# Altium schematic sheet ICtester.SchDoc
size B; SheetNumber: 1; SheetTotal: 1
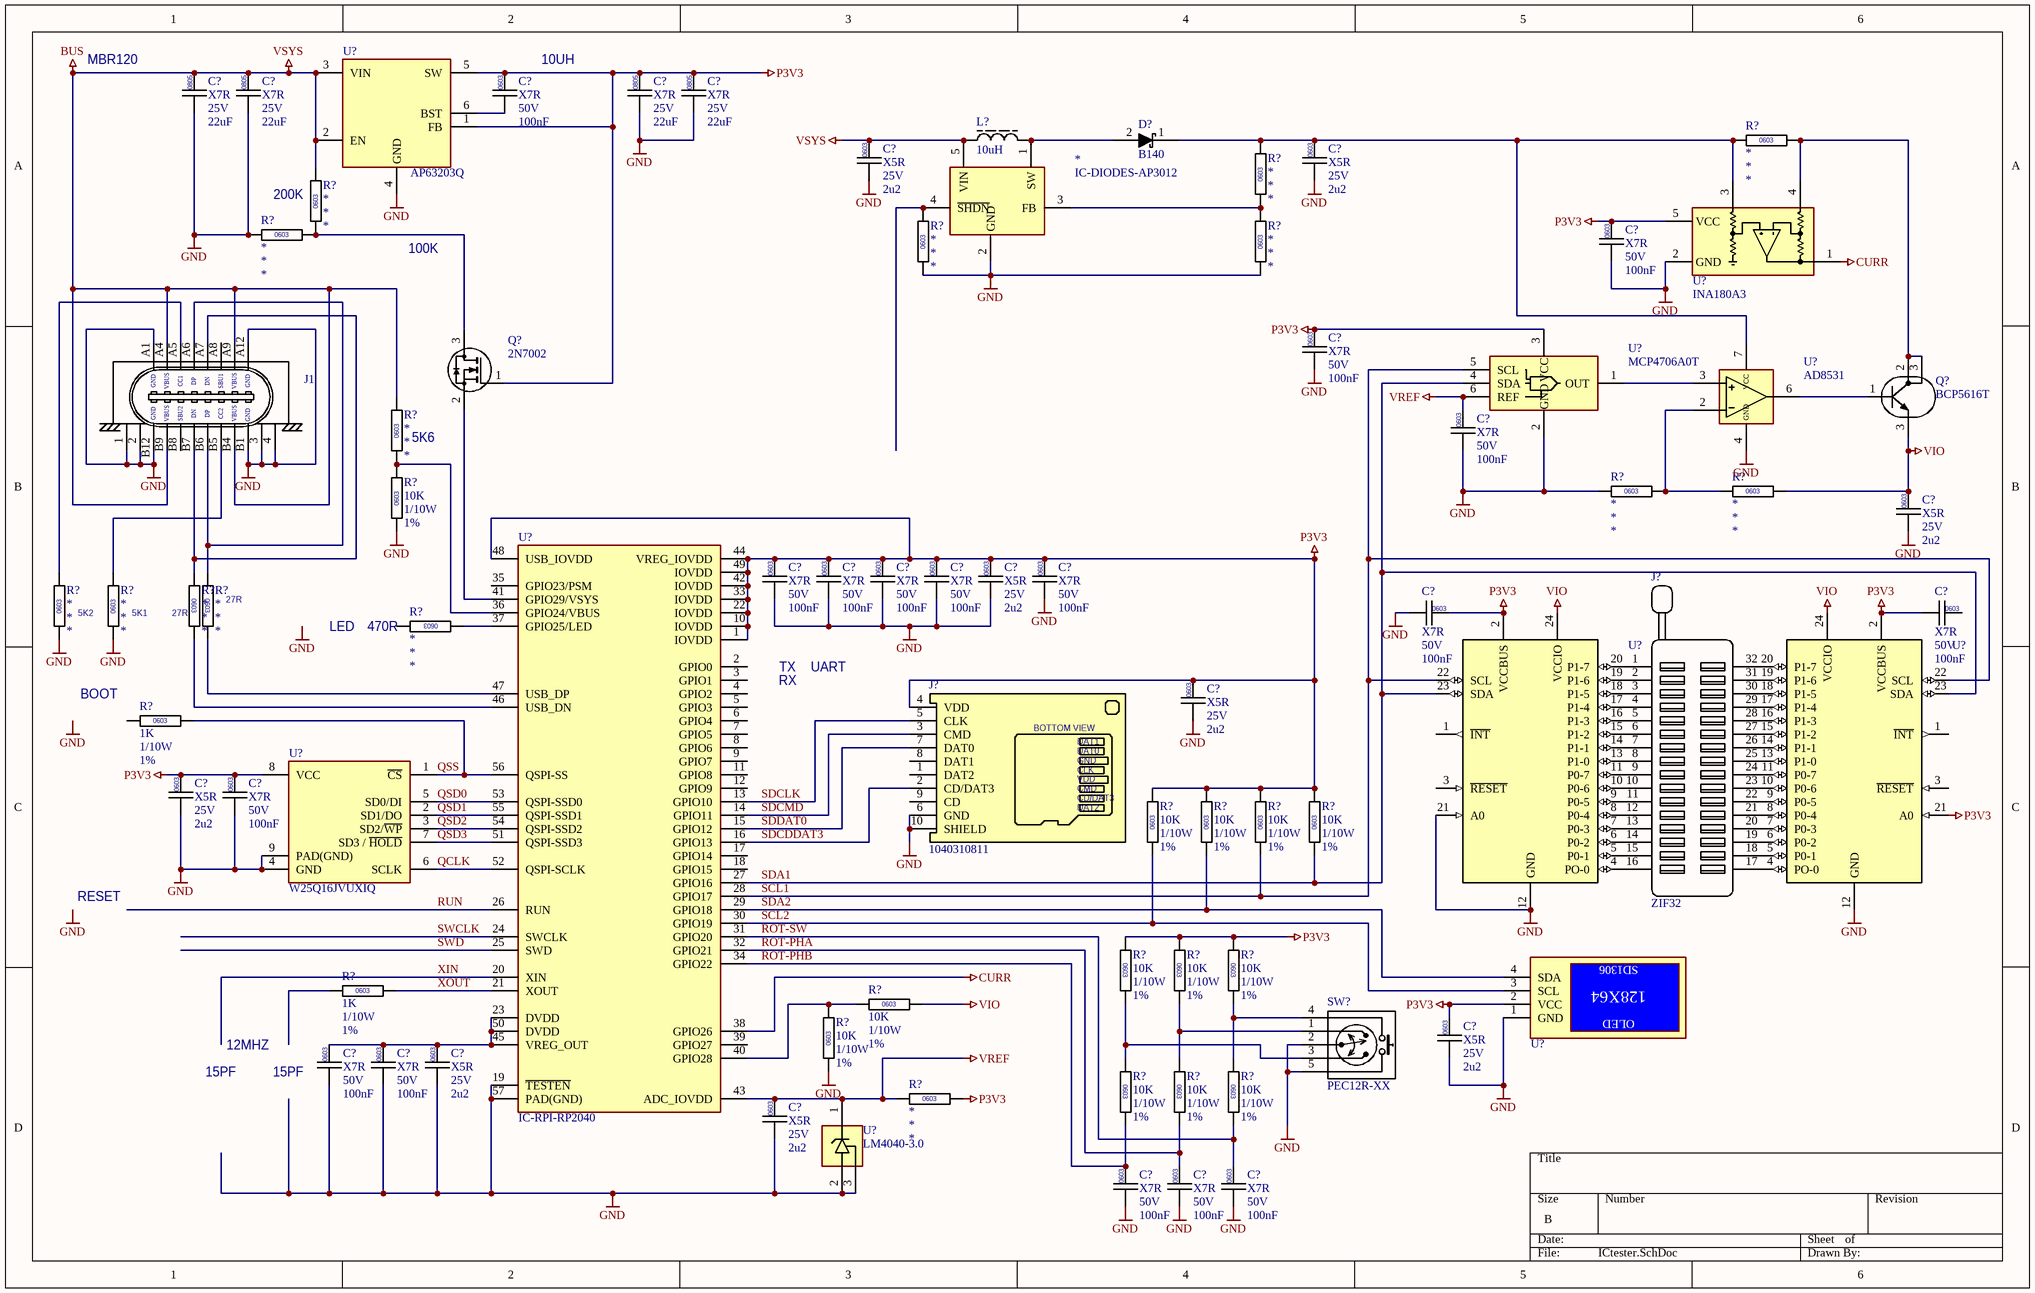
[diagram p0: ICtester.SchDoc]

## Parts
(Parts that share a designator on the sheet are numbered #1, #2 ... from top to bottom, then left to right.)
*  IC-DIODES-AP3012
C?#1  Dielectric: X7R  Voltage: 25V  Capacitance: 22uF  (hidden comment: CAP0805)
C?#2  Dielectric: X7R  Voltage: 25V  Capacitance: 22uF  (hidden comment: CAP0805)
C?#3  Dielectric: X7R  Voltage: 50V  Capacitance: 100nF  (hidden comment: CAP0603)
C?#4  Dielectric: X7R  Voltage: 25V  Capacitance: 22uF  (hidden comment: CAP0805)
C?#5  Dielectric: X7R  Voltage: 25V  Capacitance: 22uF  (hidden comment: CAP0805)
C?#6  Dielectric: X5R  Voltage: 25V  Capacitance: 2u2  (hidden comment: CAP0603)
C?#7  Dielectric: X5R  Voltage: 25V  Capacitance: 2u2  (hidden comment: CAP0603)
C?#8  Dielectric: X7R  Voltage: 50V  Capacitance: 100nF  (hidden comment: CAP0603)
C?#9  Dielectric: X7R  Voltage: 50V  Capacitance: 100nF  (hidden comment: CAP0603)
C?#10  Dielectric: X7R  Voltage: 50V  Capacitance: 100nF  (hidden comment: CAP0603)
C?#11  Dielectric: X5R  Voltage: 25V  Capacitance: 2u2  (hidden comment: CAP0603)
C?#12  Dielectric: X7R  Voltage: 50V  Capacitance: 100nF  (hidden comment: CAP0603)
C?#13  Dielectric: X7R  Voltage: 50V  Capacitance: 100nF  (hidden comment: CAP0603)
C?#14  Dielectric: X7R  Voltage: 50V  Capacitance: 100nF  (hidden comment: CAP0603)
C?#15  Dielectric: X7R  Voltage: 50V  Capacitance: 100nF  (hidden comment: CAP0603)
C?#16  Dielectric: X5R  Voltage: 25V  Capacitance: 2u2  (hidden comment: CAP0603)
C?#17  Dielectric: X7R  Voltage: 50V  Capacitance: 100nF  (hidden comment: CAP0603)
C?#18  Dielectric: X7R  Voltage: 50V  Capacitance: 100nF  (hidden comment: CAP0603)
C?#19  Dielectric: X7R  Voltage: 50V  Capacitance: 100nF  (hidden comment: CAP0603)
C?#20  Dielectric: X5R  Voltage: 25V  Capacitance: 2u2  (hidden comment: CAP0603)
C?#21  Dielectric: X5R  Voltage: 25V  Capacitance: 2u2  (hidden comment: CAP0603)
C?#22  Dielectric: X7R  Voltage: 50V  Capacitance: 100nF  (hidden comment: CAP0603)
C?#23  Dielectric: X5R  Voltage: 25V  Capacitance: 2u2  (hidden comment: CAP0603)
C?#24  Dielectric: X7R  Voltage: 50V  Capacitance: 100nF  (hidden comment: CAP0603)
C?#25  Dielectric: X7R  Voltage: 50V  Capacitance: 100nF  (hidden comment: CAP0603)
C?#26  Dielectric: X5R  Voltage: 25V  Capacitance: 2u2  (hidden comment: CAP0603)
C?#27  Dielectric: X5R  Voltage: 25V  Capacitance: 2u2  (hidden comment: CAP0603)
C?#28  Dielectric: X7R  Voltage: 50V  Capacitance: 100nF  (hidden comment: CAP0603)
C?#29  Dielectric: X7R  Voltage: 50V  Capacitance: 100nF  (hidden comment: CAP0603)
C?#30  Dielectric: X7R  Voltage: 50V  Capacitance: 100nF  (hidden comment: CAP0603)
D?  B140
J1  CONN-USBC-USB2-HOR  [CONN-GCT-USB4085]  (value not drawn)
J?#1  ZIF32
J?#2  1040310811
L?  10uH
Q?#1  2N7002
Q?#2  BCP5616T
R?#1  RESC0603  [0805R-10K]  (value not drawn)
R?#2  RESC0603  [0805R-10K]  (value not drawn)
R?#3  RESC0603  [0805R-10K]  (value not drawn)
R?#4  RESC0603  [0805R-10K]  (value not drawn)
R?#5  RESC0603  [0805R-10K]  (value not drawn)
R?#6  RESC0603  [0805R-10K]  (value not drawn)
R?#7  RESC0603  [0805R-10K]  (value not drawn)
R?#8  value 10K  Power: 1/10W  Tolerance: 1%  [0805R-10K]  (hidden comment: RESC0603)
R?#9  RESC0603  [0805R-10K]  (value not drawn)
R?#10  RESC0603  [0805R-10K]  (value not drawn)
R?#11  RESC0603  [0805R-10K]  (value not drawn)
R?#12  RESC0603  [0805R-10K]  (value not drawn)
R?#13  RESC0603  [0805R-10K]  (value not drawn)
R?#14  RESC0603  [0805R-10K]  (value not drawn)
R?#15  RESC0603  [0805R-10K]  (value not drawn)
R?#16  value 1K  Power: 1/10W  Tolerance: 1%  [0805R-10K]  (hidden comment: RESC0603)
R?#17  value 10K  Power: 1/10W  Tolerance: 1%  [0805R-10K]  (hidden comment: RESC0603)
R?#18  value 10K  Power: 1/10W  Tolerance: 1%  [0805R-10K]  (hidden comment: RESC0603)
R?#19  value 10K  Power: 1/10W  Tolerance: 1%  [0805R-10K]  (hidden comment: RESC0603)
R?#20  value 10K  Power: 1/10W  Tolerance: 1%  [0805R-10K]  (hidden comment: RESC0603)
R?#21  value 1K  Power: 1/10W  Tolerance: 1%  [0805R-10K]  (hidden comment: RESC0603)
R?#22  value 10K  Power: 1/10W  Tolerance: 1%  [0805R-10K]  (hidden comment: RESC0603)
R?#23  value 10K  Power: 1/10W  Tolerance: 1%  [0805R-10K]  (hidden comment: RESC0603)
R?#24  value 10K  Power: 1/10W  Tolerance: 1%  [0805R-10K]  (hidden comment: RESC0603)
R?#25  value 10K  Power: 1/10W  Tolerance: 1%  [0805R-10K]  (hidden comment: RESC0603)
R?#26  value 10K  Power: 1/10W  Tolerance: 1%  [0805R-10K]  (hidden comment: RESC0603)
R?#27  RESC0603  [0805R-10K]  (value not drawn)
R?#28  value 10K  Power: 1/10W  Tolerance: 1%  [0805R-10K]  (hidden comment: RESC0603)
R?#29  value 10K  Power: 1/10W  Tolerance: 1%  [0805R-10K]  (hidden comment: RESC0603)
R?#30  value 10K  Power: 1/10W  Tolerance: 1%  [0805R-10K]  (hidden comment: RESC0603)
SW?  PEC12R-XX
U?#1  AP63203Q
U?#2  INA180A3
U?#3  MCP4706A0T
U?#4  AD8531
U?#5  IC-RPI-RP2040
U?#6  PCAL6416APW  (value not drawn)
U?#7  PCAL6416APW  (value not drawn)
U?#8  W25Q16JVUXIQ  [SO127P600-8N]
U?#9  MODULE-OLED-I2C-1.3  (value not drawn)
U?#10  LM4040-3.0

## Nets
BUS: *.5(VIN) C?#1.1 C?#2.1 C?#6.1 J1.A4 J1.A9 J1.B4 J1.B9 L?.1 R?#2.1 R?#7.1 U?#1.2(EN) U?#1.3(VIN)  [also labelled VSYS]
CURR: U?#2.1(OUT) U?#5.38(GPIO26)
GND: *.2(GND) C?#1.2 C?#2.2 C?#4.2 C?#5.2 C?#6.2 C?#7.2 C?#8.2 C?#9.2 C?#10.2 C?#11.2 C?#12.2 C?#13.2 C?#14.2 C?#15.2 C?#16.2 C?#17.2 C?#18.2 C?#20.2 C?#21.2 C?#22.2 C?#23.2 C?#24.2 C?#25.2 C?#26.2 C?#27.2 C?#28.2 C?#29.2 C?#30.2 J1.1 J1.2 J1.3 J1.4 J1.A1 J1.A12 J1.B1 J1.B12 J?#2.6(GND) J?#2.10(SHIELD) R?#4.2 R?#5.1 R?#6.1 R?#8.2 R?#9.1 R?#11.2 R?#12.2 R?#22.2 SW?.2 SW?.5 U?#1.4(GND) U?#2.2(GND) U?#3.2(GND) U?#4.4(GND) U?#5.19(~{TESTEN}) U?#5.57(PAD(GND)) U?#6.12(GND) U?#6.21(A0) U?#7.12(GND) U?#8.4(GND) U?#8.9(PAD(GND)) U?#9.1(GND) U?#10.2 U?#10.3
P3V3: C?#3.1 C?#4.1 C?#5.1 C?#8.1 C?#9.1 C?#12.1 C?#13.1 C?#14.1 C?#15.1 C?#16.1 C?#17.1 C?#18.1 C?#19.2 C?#20.1 C?#21.1 C?#22.1 C?#23.1 J?#2.4(VDD) Q?#1.1(G1) R?#17.1 R?#18.1 R?#19.1 R?#20.1 R?#24.2 R?#25.2 R?#26.2 R?#27.2 U?#1.1(FB) U?#1.5(SW) U?#2.5(VCC) U?#3.3(VCC) U?#5.1(IOVDD) U?#5.10(IOVDD) U?#5.22(IOVDD) U?#5.33(IOVDD) U?#5.42(IOVDD) U?#5.44(VREG_IOVDD) U?#5.48(USB_IOVDD) U?#5.49(IOVDD) U?#6.2(VCCBUS) U?#7.2(VCCBUS) U?#7.21(A0) U?#8.8(VCC) U?#9.2(VCC)
VIO: C?#11.1 Q?#2.3(E) R?#10.2 R?#23.1 U?#6.24(VCCIO) U?#7.24(VCCIO)
VREF: C?#10.1 C?#27.1 R?#27.1 U?#3.6(REF) U?#5.43(ADC_IOVDD) U?#10.1
QCLK: U?#5.52(QSPI-SCLK) U?#8.6(SCLK)
QSD0: U?#5.53(QSPI-SSD0) U?#8.5(SD0/DI)
QSD1: U?#5.55(QSPI-SSD1) U?#8.2(SD1/DO)
QSD2: U?#5.54(QSPI-SSD2) U?#8.3(SD2/~{WP})
QSD3: U?#5.51(QSPI-SSD3) U?#8.7(SD3_/_~{HOLD})
QSS: R?#16.2 U?#5.56(QSPI-SS) U?#8.1(~{CS})
ROT-PHA: C?#29.1 R?#29.1 U?#5.32(GPIO21)
ROT-PHB: C?#28.1 R?#28.1 U?#5.34(GPIO22)
ROT-SW: C?#30.1 R?#30.1 U?#5.31(GPIO20)
RUN: U?#5.26(RUN)
SCL1: R?#19.2 U?#3.5(SCL) U?#5.28(GPIO17) U?#6.22(SCL) U?#7.22(SCL)
SCL2: R?#17.2 U?#5.30(GPIO19) U?#9.3(SCL)
SDA1: R?#20.2 U?#3.4(SDA) U?#5.27(GPIO16) U?#6.23(SDA) U?#7.23(SDA)
SDA2: R?#18.2 U?#5.29(GPIO18) U?#9.4(SDA)
SDCDDAT3: J?#2.2(CD/DAT3) U?#5.16(GPIO13)
SDCLK: J?#2.5(CLK) U?#5.13(GPIO10)
SDCMD: J?#2.3(CMD) U?#5.14(GPIO11)
SDDAT0: J?#2.7(DAT0) U?#5.15(GPIO12)
SWCLK: U?#5.24(SWCLK)
SWD: U?#5.25(SWD)
XIN: U?#5.20(XIN)
XOUT: R?#21.2 U?#5.21(XOUT)
Net*_1: *.1(SW) D?.2(A) L?.2
Net*_3: *.3(FB) R?#3.1 R?#6.2
Net*_4: *.4(~{SHDN}) R?#5.2
NetC?#3_2: C?#3.2 U?#1.6(BST)
NetC?#7_1: C?#7.1 D?.1(K) R?#1.1 R?#3.2 U?#2.3(INP) U?#4.7(VCC)
NetC?#24_1: C?#24.1 C?#25.1 C?#26.1 U?#5.23(DVDD) U?#5.45(VREG_OUT) U?#5.50(DVDD)
NetJ1_A5: J1.A5 R?#11.1
NetJ1_A6: J1.A6 J1.B6 R?#15.2
NetJ1_A7: J1.A7 J1.B7 R?#14.2
NetJ1_B5: J1.B5 R?#12.1
NetJ?#1_1: J?#1.1 U?#6.20(P1-7)
NetJ?#1_2: J?#1.2 U?#6.19(P1-6)
NetJ?#1_3: J?#1.3 U?#6.18(P1-5)
NetJ?#1_4: J?#1.4 U?#6.17(P1-4)
NetJ?#1_5: J?#1.5 U?#6.16(P1-3)
NetJ?#1_6: J?#1.6 U?#6.15(P1-2)
NetJ?#1_7: J?#1.7 U?#6.14(P1-1)
NetJ?#1_8: J?#1.8 U?#6.13(P1-0)
NetJ?#1_9: J?#1.9 U?#6.11(P0-7)
NetJ?#1_10: J?#1.10 U?#6.10(P0-6)
NetJ?#1_11: J?#1.11 U?#6.9(P0-5)
NetJ?#1_12: J?#1.12 U?#6.8(P0-4)
NetJ?#1_13: J?#1.13 U?#6.7(P0-3)
NetJ?#1_14: J?#1.14 U?#6.6(P0-2)
NetJ?#1_15: J?#1.15 U?#6.5(P0-1)
NetJ?#1_16: J?#1.16 U?#6.4(PO-0)
NetJ?#1_17: J?#1.17 U?#7.4(PO-0)
NetJ?#1_18: J?#1.18 U?#7.5(P0-1)
NetJ?#1_19: J?#1.19 U?#7.6(P0-2)
NetJ?#1_20: J?#1.20 U?#7.7(P0-3)
NetJ?#1_21: J?#1.21 U?#7.8(P0-4)
NetJ?#1_22: J?#1.22 U?#7.9(P0-5)
NetJ?#1_23: J?#1.23 U?#7.10(P0-6)
NetJ?#1_24: J?#1.24 U?#7.11(P0-7)
NetJ?#1_25: J?#1.25 U?#7.13(P1-0)
NetJ?#1_26: J?#1.26 U?#7.14(P1-1)
NetJ?#1_27: J?#1.27 U?#7.15(P1-2)
NetJ?#1_28: J?#1.28 U?#7.16(P1-3)
NetJ?#1_29: J?#1.29 U?#7.17(P1-4)
NetJ?#1_30: J?#1.30 U?#7.18(P1-5)
NetJ?#1_31: J?#1.31 U?#7.19(P1-6)
NetJ?#1_32: J?#1.32 U?#7.20(P1-7)
NetQ?#1_2: Q?#1.2(S) U?#5.41(GPIO29/VSYS)
NetQ?#1_3: Q?#1.3(D) R?#2.2 R?#4.1
NetQ?#2_1: Q?#2.1(B) U?#4.6(OUT)
NetQ?#2_2: Q?#2.2(C) Q?#2.3(C) R?#1.2 U?#2.4(INN)
NetR?#7_2: R?#7.2 R?#8.1 U?#5.36(GPIO24/VBUS)
NetR?#9_2: R?#9.2 R?#10.1 U?#4.2(-)
NetR?#13_2: R?#13.2 U?#5.37(GPIO25/LED)
NetR?#14_1: R?#14.1 U?#5.46(USB_DN)
NetR?#15_1: R?#15.1 U?#5.47(USB_DP)
NetR?#22_1: R?#22.1 R?#23.2 U?#5.40(GPIO28)
NetR?#24_1: R?#24.1 R?#28.2 SW?.3
NetR?#25_1: R?#25.1 R?#29.2 SW?.1
NetR?#26_1: R?#26.1 R?#30.2 SW?.4
NetU?#3_1: U?#3.1(OUT) U?#4.3(+)

Not connected (* = marked no-connect by the designer): C?#19 1; J1 A8 B8; J?#2 1(DAT2) 8(DAT1) 9(CD); R?#13 1; R?#16 1; R?#21 1; U?#5 2(GPIO0) 3(GPIO1) 4(GPIO2) 5(GPIO3) 6(GPIO4) 7(GPIO5) 8(GPIO6) 9(GPIO7) 11(GPIO8) 12(GPIO9) 17(GPIO14) 18(GPIO15) 35(GPIO23/PSM) 39(GPIO27); U?#6 1(~{INT}) 3(~{RESET}); U?#7 1(~{INT}) 3(~{RESET})

## Notes on the sheet
- MBR120
- (near C?#3) 10UH
- (near R?#2) 200K
- 100K
- (near R?#7) 5K6
- (near R?#12) 5K2
- (near R?#12) 5K1
- (near R?#14) 27R
- (near R?#15) 27R
- LED
- (near R?#13) 470R
- (near R?#16) BOOT
- TX
- RX
- UART
- RESET
- 12MHZ
- 15PF
- (near C?#24) 15PF
- Labels drawn without touching a wire or pin: GND
- (in symbol CAPC-0805-22uF-25V) 0805
- (in symbol CONN-MOLEX-1040310811) BOTTOM VIEW
- (in symbol CONN-USBC-USB2-HOR) GND; VBUS; CC1; DP; DN; SBU1; SBU2; CC2
- (in symbol MODULE-OLED-I2C-1.3) SD1306; 128X64; OLED
- (in symbol RESC-0603-1K-1%-1/10W) 0603
- (in symbol RESC-0603-10K-1%-1/10W) 0603
- (in symbol RESC-0603-GENERIC) 0603

## Library data of the parts
C?#1 C?#2 C?#4 C?#5 = CAPC-0805-22uF-25V: CAPACITOR,CERAMIC,22uF,25V,X5R,0805 (2012); Package / Case: 0805 (2012 metric); Location: *
C?#3 C?#8-C?#10 C?#12-C?#15 C?#17-C?#19 C?#22 C?#24 C?#25 C?#28-C?#30 = CAPC-0603-100nF-50V-X7R: CAPACITOR,CERAMIC,100nF,50V,X7R,0603; Package / Case: 0603; Location: *; Supplier 1: Mouser; Supplier Part Number 1: 80-C0603C104K5R7867; Supplier 2: Mouser; Supplier Part Number 2: 80-C0603C104K5R7411; Supplier 3: Avnet; Supplier Part Number 3: KGM15BR71H104KT; Supplier 4: Digikey; Supplier Part Number 4: 1276-1000-1-ND
C?#6 C?#7 C?#11 C?#16 C?#20 C?#21 C?#23 C?#26 C?#27 = CAPC-0603-2U2-25V-X5R: CAPACITOR,CERAMIC,2u2,25V,X5R,0603; Package / Case: 0603; Location: *; Supplier 1: Digikey; Supplier Part Number 1: 587-2909-1-ND; Supplier 2: Mouser; Supplier Part Number 2: 81-GRM188R61E225KA2D; Supplier 3: Digikey; Supplier Part Number 3: 445-5964-1-ND
D? = DIODE-DIODES-B140B-13-F
J1 = CONN-USBC-USB2-HOR: USB-C, RIGHT ANGLE
J?#1 = CONN-ZIF-32
J?#2 = CONN-MOLEX-1040310811: CONN,MICROSD,MOLEX 1040310811; Supplier 1: Arrow Electronics; Supplier Part Number 1: 1040310811
L? = IND-WURTH-74438336100
Q?#1 = XSTR-2N7002-SOT23: XSTR,NMOS,2N7002,SOT23; Vds: 60V; Idmax: 0.3A; Supplier 1: Future Electronics; Supplier Part Number 1: 8129513; Supplier 2: Mouser; Supplier Part Number 2: 726-2N7002H6327XTSA2; Supplier 3: Future Electronics; Supplier Part Number 3: 8072658; Supplier 4: Future Electronics; Supplier Part Number 4: 9187976; Supplier 5: Avnet; Supplier Part Number 5: 2N7002KT1G; Supplier 6: Mouser; Supplier Part Number 6: 781-2N7002-T1-E3; Package: SOT23
Q?#2 = XSTR-DIODES-BCP5616T
R?#1-R?#7 R?#9-R?#15 R?#27 = RESC-0603-GENERIC: RESISTOR,; Location: *; Parameter 4: *; Power: *; Tolerance: *; Value: *
R?#8 R?#17-R?#20 R?#22-R?#26 R?#28-R?#30 = RESC-0603-10K-1%-1/10W: RESISTOR,10K,1%,100mW,0603 (1608); Location: *; Supplier 1: Future Electronics; Supplier Part Number 1: 4023214; Supplier 2: Digikey; Supplier Part Number 2: RMCF0603FT10K0CT-ND; Supplier 3: Mouser; Supplier Part Number 3: 667-ERJ-3EKF1002V
R?#16 R?#21 = RESC-0603-1K-1%-1/10W: RESISTOR,1K,1%,100mW,0603 (1608); Location: *
SW? = SWITCH-BOURNS-PEC12R
U?#1 = IC-DIODES-AP63203Q: Supplier 1: Digikey; Supplier Part Number 1: 31-AP63203QWU-7CT-ND
U?#2 = IC-TI-INA180A3
U?#3 = IC-MICROCHIP-MCP4706A0T
U?#4 = IC-ANALOG-AD8531-SO8
U?#6 U?#7 = IC-NEXPERIA-PCAL6416APW: 16BIT AGILE, LEVEL SHIFTING I/O EXPANDER; Supplier 1: Arrow Electronics; Supplier Part Number 1: PCAL6416APW,118
U?#8 = IC-WINBOND-W25Q16JVUXIQ: Supplier 1: Digikey; Supplier Part Number 1: 256-W25Q16JVUXIQTRCT-ND
U?#10 = IC-TI-LM4040-3